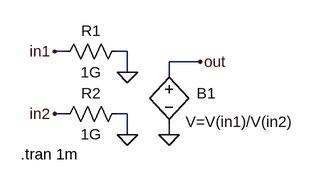
[diagram p0: schematic Div.asc]
Div.asc, the LTspice schematic file:
Version 4
SHEET 1 880 680
WIRE 96 64 80 64
WIRE 192 64 176 64
WIRE 304 80 256 80
WIRE 192 96 192 64
WIRE 256 96 256 80
WIRE 96 160 80 160
WIRE 192 160 176 160
WIRE 192 192 192 160
WIRE 256 192 256 176
FLAG 256 192 0
FLAG 80 64 in1
FLAG 304 80 out
FLAG 192 96 0
FLAG 80 160 in2
FLAG 192 192 0
SYMBOL bv 256 80 R0
WINDOW 0 43 48 Left 0
WINDOW 3 26 92 Left 0
SYMATTR InstName B1
SYMATTR Value V=V(in1)/V(in2)
SYMBOL res 80 80 R270
WINDOW 0 32 56 VTop 0
WINDOW 3 0 56 VBottom 0
SYMATTR InstName R1
SYMATTR Value 1G
SYMBOL res 80 176 R270
WINDOW 0 32 56 VTop 0
WINDOW 3 0 56 VBottom 0
SYMATTR InstName R2
SYMATTR Value 1G
TEXT 28 222 Left 0 !.tran 1m

The netlist it stands for:
* Div.asc
B1 out 0 V=V(in1)/V(in2)
R1 in1 0 1G
R2 in2 0 1G
.tran 1m
.backanno
.end